# EAGLE schematic untitled (EAGLE 9.5.0)
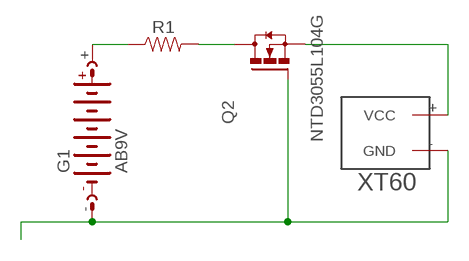
[diagram p0: schematic, sheet 1]

## Parts
G1  AB9V  [AB9V]
Q2  NTD3055L104G  [DPAK4]
R1  RESISTORAXIAL-0.3-KIT  [AXIAL-0.3-KIT]
U$1  XT60  [XT60]

## Nets
N$1: G1.- Q2.1(G) U$1.-(GND)
N$2: G1.+ R1.P$1
N$3: Q2.2(D) Q2.4(D) R1.P$2
N$4: Q2.3(S) U$1.+(VCC)

## Library data of the parts
G1 = battery:AB9V: 9-V BATTERY CLIP
Q2 = Transistor:NTD3055L104G: 12 A, 60 V, Logic Level N−Channel DPAK/IPAK Manufacturer's datasheet <https://www.onsemi.com/pub/Collateral/NTD3055L104-D.PDF>; CREATED_BY: PCBLayout.com; MANUFACTURER: ON SEMICONDUCTORS; MPN: NTD3055L104G; PACKAGE: DPAK-4
R1 = SparkFun-Resistors:RESISTOR: Generic Resistor Package
U$1 = XT60:XT60: XT60